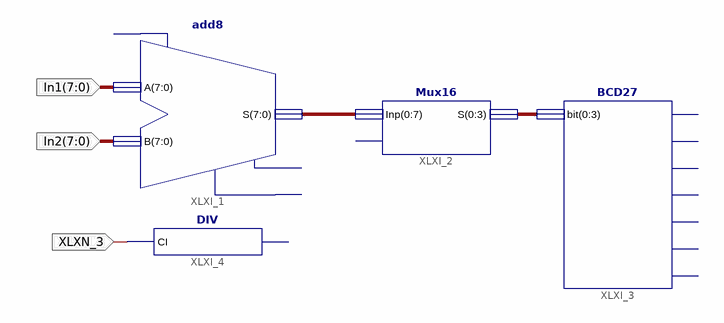
[diagram p0: schematic sheet 1]
// Xilinx ISE schematic Add.sch (spartan6) as structural Verilog: 4 symbols, 3 ports
module Add (
  input  [7:0] In1,
  input  [7:0] In2,
  input  XLXN_3
);

  wire [3:0] XLXN_2;
  wire [7:0] XLXN_1;

  add8 XLXI_1 (
    .A(In1), .B(In2),
    .S({XLXN_1[0], XLXN_1[1], XLXN_1[2], XLXN_1[3], XLXN_1[4], XLXN_1[5], XLXN_1[6], XLXN_1[7]}));  // open: CI, CO, OFL
  Mux16 XLXI_2 (
    .Inp({XLXN_1[0], XLXN_1[1], XLXN_1[2], XLXN_1[3], XLXN_1[4], XLXN_1[5], XLXN_1[6], XLXN_1[7]}),
    .S({XLXN_2[0], XLXN_2[1], XLXN_2[2], XLXN_2[3]}));  // open: Clock
  BCD27 XLXI_3 (.\bit ({XLXN_2[0], XLXN_2[1], XLXN_2[2], XLXN_2[3]}));  // open: A_7, B_7, C_7, D_7, E_7, F_7, G_7
  DIV XLXI_4 (.CI(XLXN_3));  // open: CO
endmodule
